# Altium schematic sheet FPGA3.SchDoc
size A4; SheetNumber: 9; SheetTotal: 9
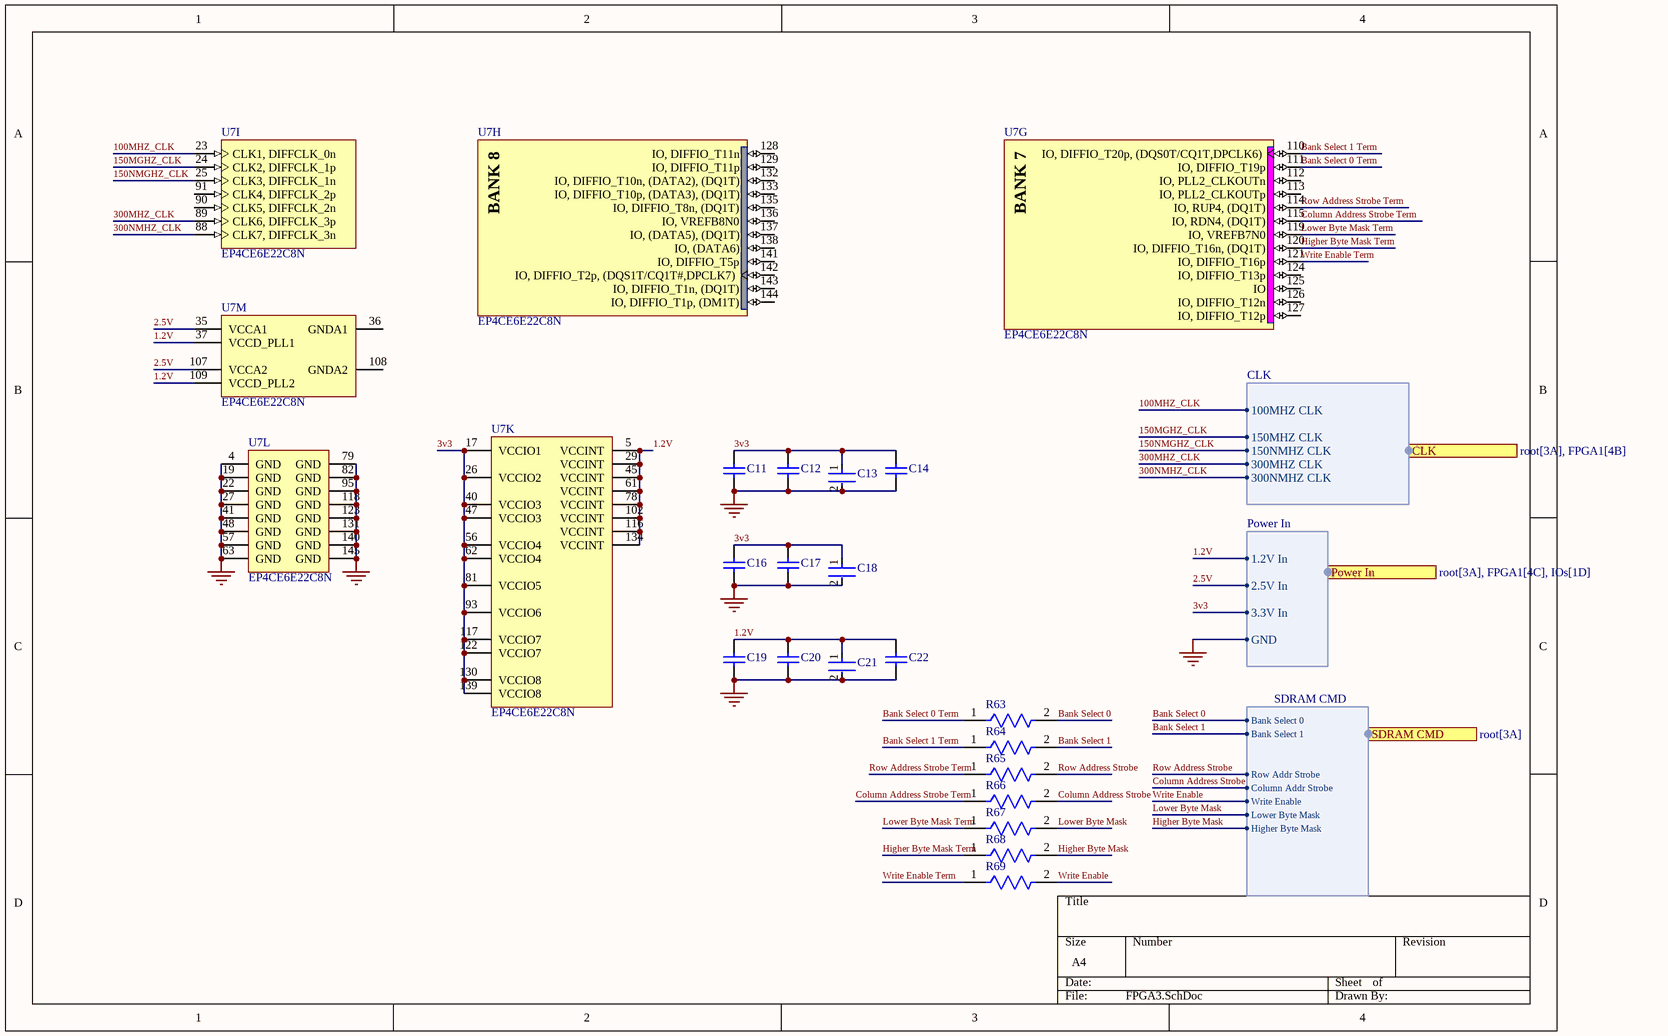
[diagram p0: FPGA3.SchDoc]

## Parts
C11  C0603C105K9PACTU  [CAPC1608X90X35LL15T15]  (value not drawn)
C12  C0603C105K9PACTU  [CAPC1608X90X35LL15T15]  (value not drawn)
C13  GCG188R91H104MA01D  [FP-GCG188-0_2-IPC_B]  (value not drawn)
C14  C0805S472K5RACTU  [CAPC2013X145X50ML20T25]  (value not drawn)
C16  C0603S102K4RACTU  [CAPC1608X87X35ML15T15]  (value not drawn)
C17  C0805S472K5RACTU  [CAPC2013X145X50ML20T25]  (value not drawn)
C18  GCG188R91H104MA01D  [FP-GCG188-0_2-IPC_B]  (value not drawn)
C19  C0603C105K9PACTU  [CAPC1608X90X35LL15T15]  (value not drawn)
C20  C0603C105K9PACTU  [CAPC1608X90X35LL15T15]  (value not drawn)
C21  GCG188R91H104MA01D  [FP-GCG188-0_2-IPC_B]  (value not drawn)
C22  C0805S472K5RACTU  [CAPC2013X145X50ML20T25]  (value not drawn)
R63  RT0402BRE0750RL  [FP-RT0402-0_35-MFG]  (value not drawn)
R64  RT0402BRE0750RL  [FP-RT0402-0_35-MFG]  (value not drawn)
R65  RT0402BRE0750RL  [FP-RT0402-0_35-MFG]  (value not drawn)
R66  RT0402BRE0750RL  [FP-RT0402-0_35-MFG]  (value not drawn)
R67  RT0402BRE0750RL  [FP-RT0402-0_35-MFG]  (value not drawn)
R68  RT0402BRE0750RL  [FP-RT0402-0_35-MFG]  (value not drawn)
R69  RT0402BRE0750RL  [FP-RT0402-0_35-MFG]  (value not drawn)
U7  EP4CE6E22C8N  [EQFP144_A-165_D2-54_M]  (parts G,H,I,K,L,M of 13)

## Ports
CLK (harness CLK, see root[3A], FPGA1[4B]), Power In (harness Power In, see root[3A], FPGA1[4C], IOs[1D]), SDRAM CMD (harness SDRAM CMD, see root[3A])

## Harnesses
Power In: 1.2V In, 2.5V In, 3.3V In, GND
CLK: 100MHZ CLK, 150MHZ CLK, 150NMHZ CLK, 300MHZ CLK, 300NMHZ CLK
SDRAM CMD: Bank Select 0, Bank Select 1, Row Addr Strobe, Column Addr Strobe, Write Enable, Lower Byte Mask, Higher Byte Mask

## Nets
GND: C11.1 C12.1 C13.2 C14.1 C16.1 C17.1 C18.2 C19.1 C20.1 C21.2 C22.1 U7.4(GND) U7.19(GND) U7.22(GND) U7.27(GND) U7.41(GND) U7.48(GND) U7.57(GND) U7.63(GND) U7.79(GND) U7.82(GND) U7.95(GND) U7.118(GND) U7.123(GND) U7.131(GND) U7.140(GND) U7.145(GND) ; port Power In.GND
1.2V: C19.2 C20.2 C21.1 C22.2 U7.5(VCCINT) U7.29(VCCINT) U7.37(VCCD_PLL1) U7.45(VCCINT) U7.61(VCCINT) U7.78(VCCINT) U7.102(VCCINT) U7.109(VCCD_PLL2) U7.116(VCCINT) U7.134(VCCINT) ; port Power In.1.2V In
2.5V: U7.35(VCCA1) U7.107(VCCA2) ; port Power In.2.5V In
3v3: C11.2 C12.2 C13.1 C14.2 C16.2 C17.2 C18.1 U7.17(VCCIO1) U7.26(VCCIO2) U7.40(VCCIO3) U7.47(VCCIO3) U7.56(VCCIO4) U7.62(VCCIO4) U7.81(VCCIO5) U7.93(VCCIO6) U7.117(VCCIO7) U7.122(VCCIO7) U7.130(VCCIO8) U7.139(VCCIO8) ; port Power In.3.3V In
100MHZ_CLK: U7.23(CLK1,_DIFFCLK_0n) ; port CLK.100MHZ CLK
150MGHZ_CLK: U7.24(CLK2,_DIFFCLK_1p) ; port CLK.150MHZ CLK
150NMGHZ_CLK: U7.25(CLK3,_DIFFCLK_1n) ; port CLK.150NMHZ CLK
300MHZ_CLK: U7.89(CLK6,_DIFFCLK_3p) ; port CLK.300MHZ CLK
300NMHZ_CLK: U7.88(CLK7,_DIFFCLK_3n) ; port CLK.300NMHZ CLK
Bank Select 0: R63.2 ; port SDRAM CMD.Bank Select 0
Bank Select 0 Term: R63.1 U7.111(IO,_DIFFIO_T19p)
Bank Select 1: R64.2 ; port SDRAM CMD.Bank Select 1
Bank Select 1 Term: R64.1 U7.110(IO,_DIFFIO_T20p,_(DQS0T/CQ1T,DPCLK6))
Column Address Strobe: R66.2 ; port SDRAM CMD.Column Addr Strobe
Column Address Strobe Term: R66.1 U7.115(IO,_RDN4,_(DQ1T))
Higher Byte Mask: R68.2 ; port SDRAM CMD.Higher Byte Mask
Higher Byte Mask Term: R68.1 U7.120(IO,_DIFFIO_T16n,_(DQ1T))
Lower Byte Mask: R67.2 ; port SDRAM CMD.Lower Byte Mask
Lower Byte Mask Term: R67.1 U7.119(IO,_VREFB7N0)
Row Address Strobe: R65.2 ; port SDRAM CMD.Row Addr Strobe
Row Address Strobe Term: R65.1 U7.114(IO,_RUP4,_(DQ1T))
Write Enable: R69.2 ; port SDRAM CMD.Write Enable
Write Enable Term: R69.1 U7.121(IO,_DIFFIO_T16p)

Not connected (* = marked no-connect by the designer): U7 36(GNDA1) 90(CLK5,_DIFFCLK_2n) 91(CLK4,_DIFFCLK_2p) 108(GNDA2) 112(IO,_PLL2_CLKOUTn) 113(IO,_PLL2_CLKOUTp) 124(IO,_DIFFIO_T13p) 125(IO) 126(IO,_DIFFIO_T12n) 127(IO,_DIFFIO_T12p) 128(IO,_DIFFIO_T11n) 129(IO,_DIFFIO_T11p) 132(IO,_DIFFIO_T10n,_(DATA2),_(DQ1T)) 133(IO,_DIFFIO_T10p,_(DATA3),_(DQ1T)) 135(IO,_DIFFIO_T8n,_(DQ1T)) 136(IO,_VREFB8N0) 137(IO,_(DATA5),_(DQ1T)) 138(IO,_(DATA6)) 141(IO,_DIFFIO_T5p) 142(IO,_DIFFIO_T2p,_(DQS1T/CQ1T#,DPCLK7)) 143(IO,_DIFFIO_T1n,_(DQ1T)) 144(IO,_DIFFIO_T1p,_(DM1T))

## Notes on the sheet
- (in symbol CMP-0038-00212-1, part G) BANK 7
- (in symbol CMP-0038-00212-1, part H) BANK 8

## Library data of the parts
C11 C12 C19 C20 = CMP-2006-02241-1: Manufacturer: Kemet; Part Number: C0603C105K9PACTU
C13 C18 C21 = CMP-06035-011350-1: AgPd Termination Conductive Glue Mounting Chip Multilayer Ceramic Capacitors for Automotive 0.1uF with 20% as tolerance, 50V X8R 15%, 0603 Package
C14 C17 C22 = CMP-2007-01090-1: Manufacturer: Kemet; Part Number: C0805S472K5RACTU
C16 = CMP-2006-03288-1: Manufacturer: Kemet; Part Number: C0603S102K4RACTU
R63-R69 = CMP-00621-71392720-1: RT0402BRE0750RL Fixed Resistor, Thin Film, 0.0625W, 50ohm, 50V, 0.1% +/-Tol, 50ppm/Cel, Surface Mount, 0402; Max Power Dissipation: 63mW; Temperature Coefficient: 50ppm/°C; Resistance: 50Ω; Features: Moisture Resistant; Max Operating Temperature: 155°C; Tolerance: 0.1%; Min Operating Temperature: -55°C; Case/Package: 0402; Packaging: Tape & Reel; RoHS: Compliant; Width: 508µm; Height: 355.6µm; NexarPartId: 71392720; Composition: Thin Film; Length: 990.6µm; Number of Terminations: 2
U7 = CMP-0038-00212-1: Cyclone IV Family FPGA, 1.2V Core, 91 I/O Pins, 2 PLLs, 144-Pin QFP, Speed Grade 8, Commercial Grade, Pb-Free; Manufacturer: Altera; ComponentLink3Description: Pinout; ComponentLink4Description: Package Specification; DatasheetVersion: ver1.6, Nov-2011; ComponentLink1URL: http://www.altera.com/; ComponentLink2URL: http://www.altera.com/literature/hb/cyclone-iv/cyclone4-handbook.pdf; ComponentLink2Description: Handbook; PackageReference: EQFP144_A-165_D2-54; ComponentLink3URL: http://www.altera.com/literature/lit-dp.jsp?category=cyc%204&showspreadsheet=y; PackageVersion: ver1.0, Jan-2011; ComponentLink1Description: Manufacturer URL; ComponentLink4URL: http://www.altera.com/devicepackaging/04R00402-00.pdf; PackageDescription: 144-Pin Plastic Enhanced Quad Flat Pack (EQFP) - Wire Bond - A:1.65 - D2:5.4; Code_JEDEC: MS-026-BFB-HD